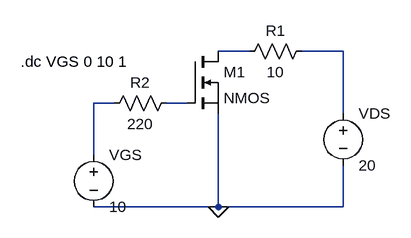
[diagram p0: schematic mosfet.asc]
mosfet.asc, the LTspice schematic file:
Version 4
SHEET 1 880 680
WIRE 560 144 512 144
WIRE 704 144 640 144
WIRE 352 224 320 224
WIRE 464 224 432 224
WIRE 704 240 704 144
WIRE 320 304 320 224
WIRE 512 384 512 240
WIRE 512 384 320 384
WIRE 704 384 704 320
WIRE 704 384 512 384
FLAG 512 384 0
SYMBOL voltage 320 288 R0
SYMATTR InstName VGS
SYMATTR Value 10
SYMBOL voltage 704 224 R0
SYMATTR InstName VDS
SYMATTR Value 20
SYMBOL res 448 208 R90
WINDOW 0 0 56 VBottom 2
WINDOW 3 32 56 VTop 2
SYMATTR InstName R2
SYMATTR Value 220
SYMBOL res 656 128 R90
WINDOW 0 0 56 VBottom 2
WINDOW 3 32 56 VTop 2
SYMATTR InstName R1
SYMATTR Value 10
SYMBOL nmos 464 144 R0
SYMATTR InstName M1
TEXT 208 160 Left 2 !.dc VGS 0 10 1

The netlist it stands for:
* mosfet.asc
VGS N003 0 10
VDS N002 0 20
R2 N004 N003 220
R1 N002 N001 10
M1 N001 N004 0 0 NMOS
.model NMOS NMOS
.model PMOS PMOS
.lib standard.mos
.dc VGS 0 10 1
.backanno
.end